# EAGLE design saw-dcc6c-breakout (EAGLE 5.11)
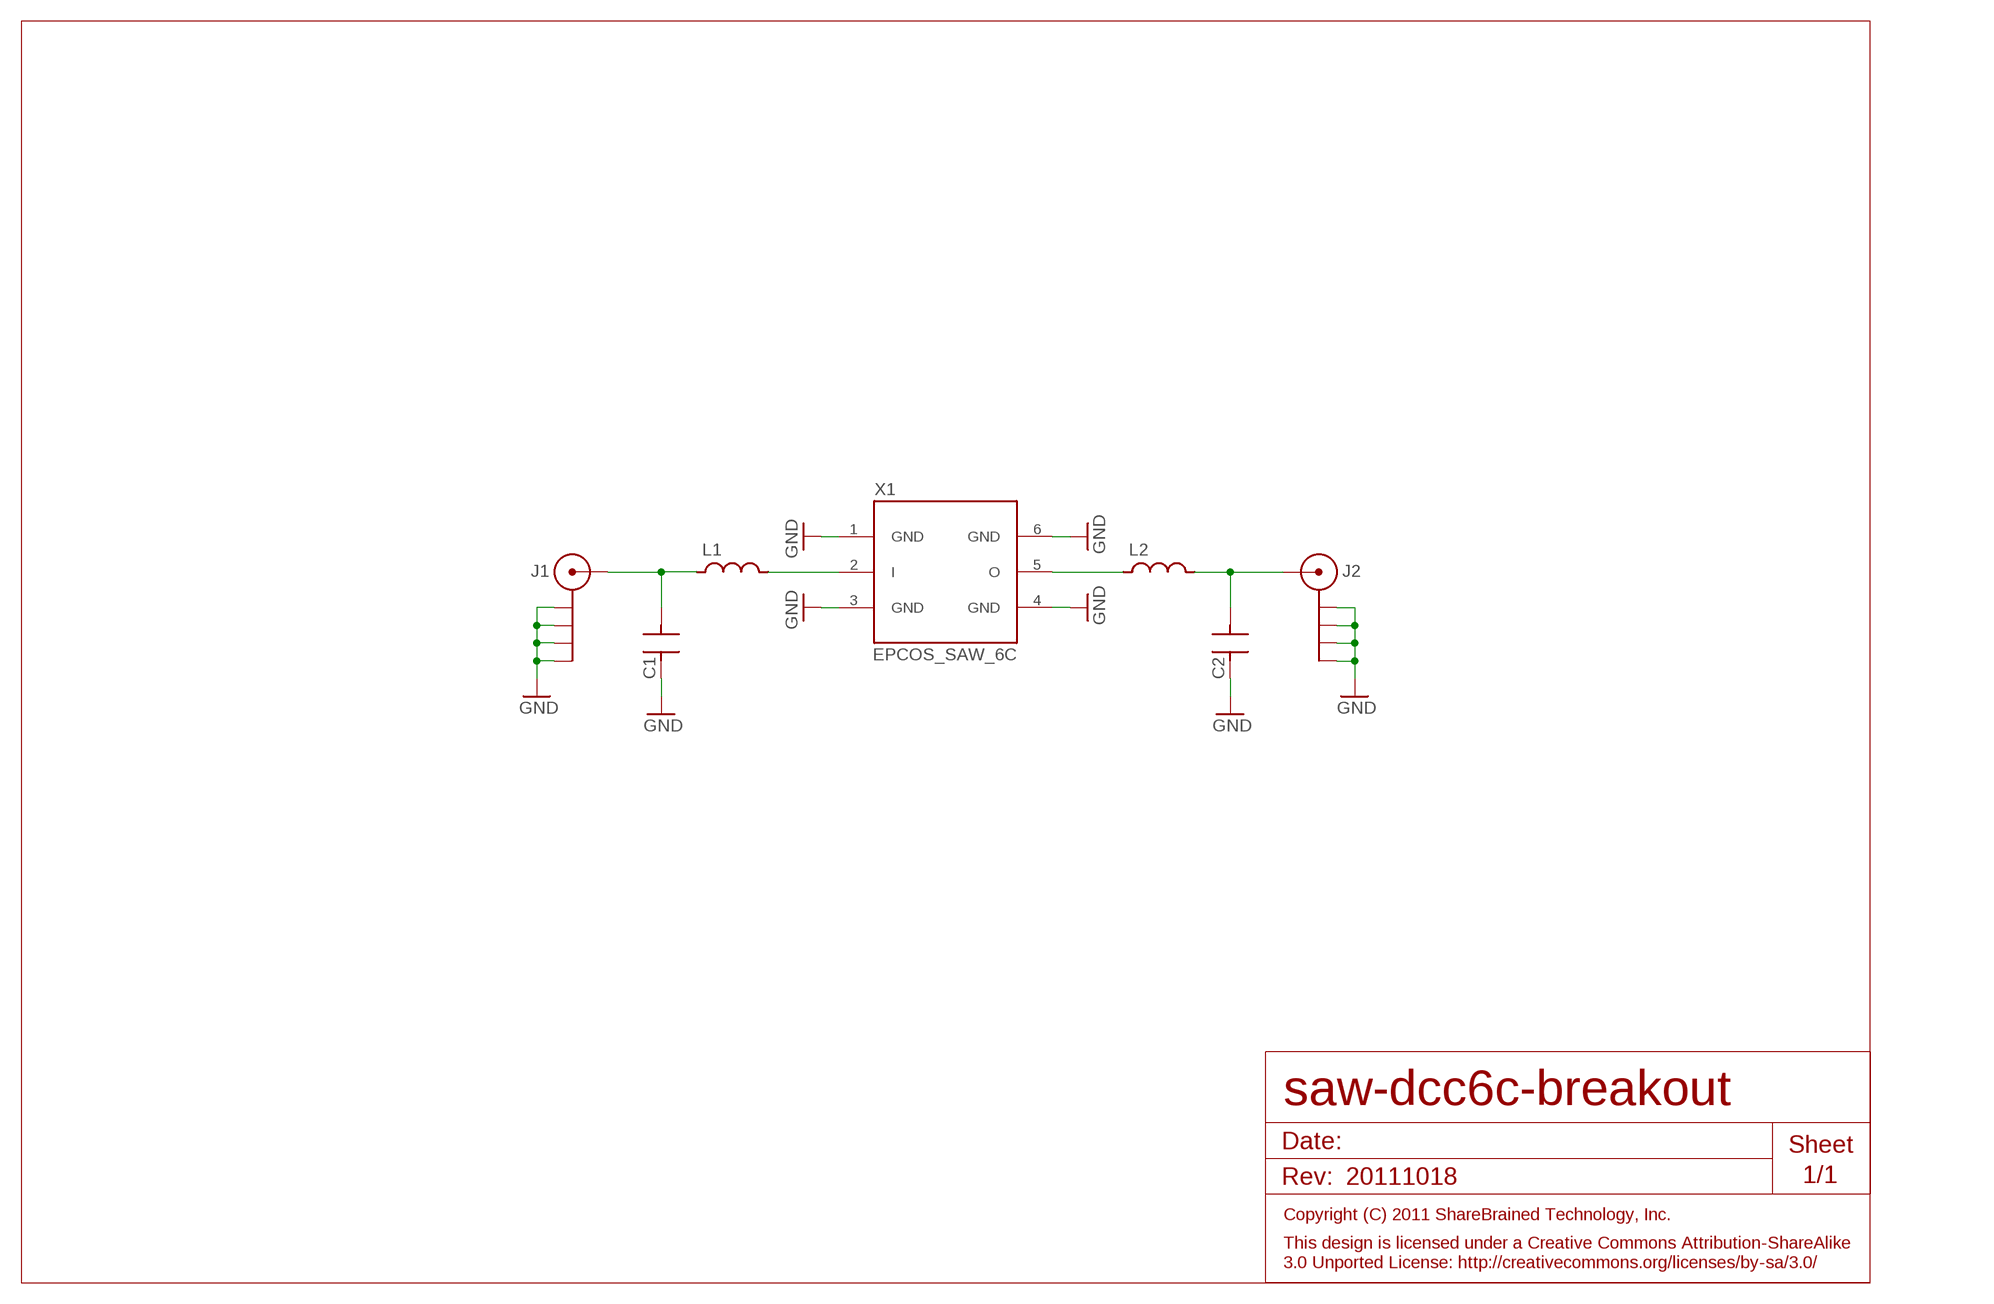
[diagram p0: schematic, sheet 1]

## Parts
C1  C0402_55  [CAPC1005X55N]
C2  C0402_55  [CAPC1005X55N]
J1  SMA142-0701-801  [142-0701-801]
J2  SMA142-0701-801  [142-0701-801]
L1  L0603_95  [INDC1608X95N]
L2  L0603_95  [INDC1608X95N]
X1  EPCOS_SAW_6C  [EPCOS_DCC6_X]

## Nets
GND: C1.1 C2.1 J1.RING@1(RING) J1.RING@2(RING) J1.RING@3(RING) J1.RING@4(RING) J2.RING@1(RING) J2.RING@2(RING) J2.RING@3(RING) J2.RING@4(RING) X1.1(GND) X1.3(GND) X1.4(GND) X1.6(GND)
N$1: L1.2 X1.2(I)
N$2: L2.1 X1.5(O)
N$3: C1.2 J1.TIP L1.1
N$4: C2.2 J2.TIP L2.2

## Notes on the sheet
- 20111018

## Library data of the parts
C1 C2 = capacitor:C
J1 J2 = sma:SMA
L1 L2 = inductor:L
X1 = filter:EPCOS_SAW_6C

## Board
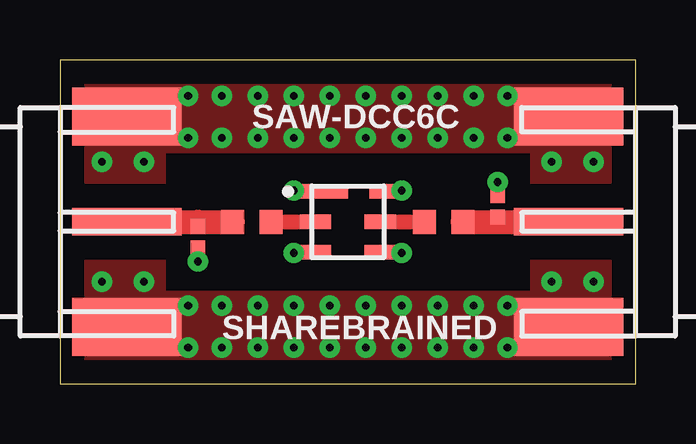
[diagram p1: board, top side]
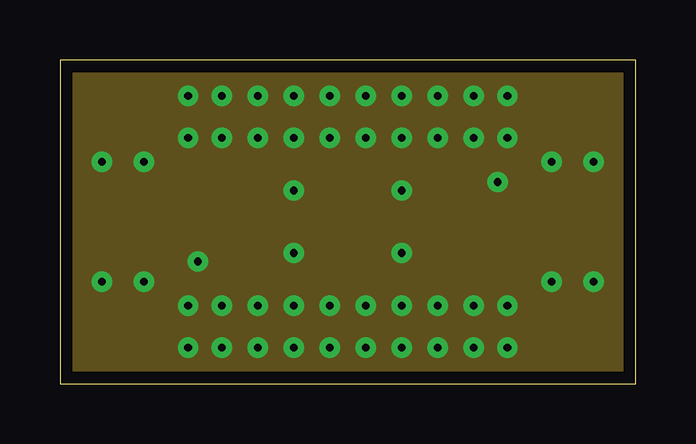
[diagram p2: board, inner layer Route2]
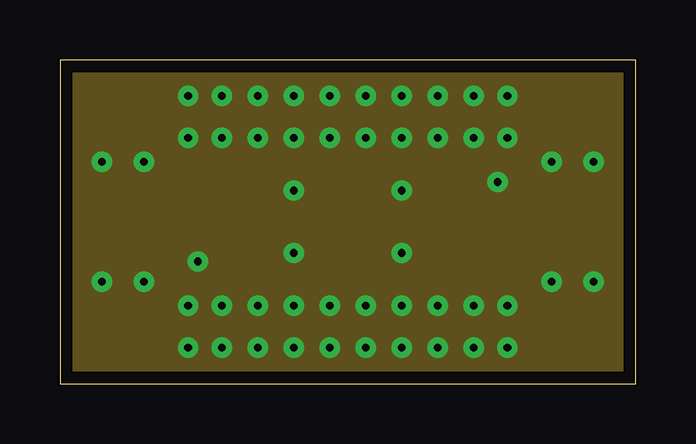
[diagram p3: board, inner layer Route15]
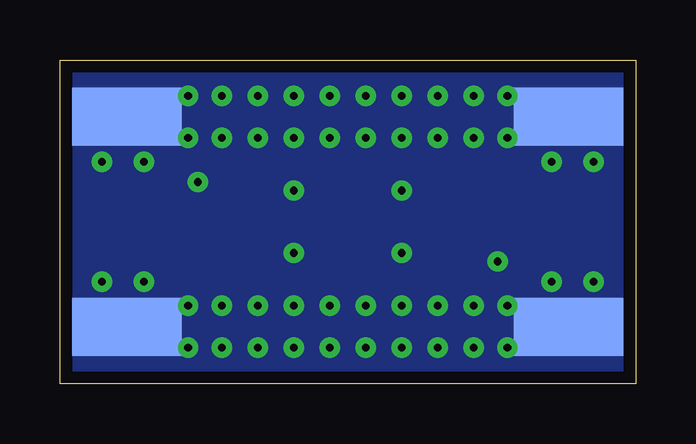
[diagram p4: board, bottom side, seen from below]

Size 24 x 13.5 mm. Coordinates in mm from the lower left corner, seen from the top.
Outline: 0,0 24,0 24,13.5 0,13.5 0,0
Copper layers (1+2*15+16): Top 0.0178mm / dielectric 0.3048mm / Route2 0.0356mm / dielectric 0.7112mm / Route15 0.0356mm / dielectric 0.3048mm / Bottom 0.0178mm
Design rules "saw-dcc6c-breakout": minimum track width 0.3mm, minimum drill 13mil, track to track 0.2mm, track to pad 0.2mm, pad to pad 0.2mm, via to via 0.2mm, smd to smd 0.2mm, copper to edge 20mil, drill to drill 16mil, minimum pad ring 10mil, minimum via ring 10mil, stop-mask expansion 3mil, vias tented up to drill 13mil, thermal gap 8mil

### Footprints (pad centres in the part's own frame; a part is rotated, then mirrored left to right if it is on the bottom)
CAPC1005X55N = smd 0.62 x 0.62: 1 -0.45,0; 2 0.45,0
142-0701-801 = smd 2.413 x 4.572: RING@1 -4.381,-2.794; RING@2 4.381,-2.794 | smd 2.413 x 4.572 bottom: RING@3 -4.381,-2.794; RING@4 4.381,-2.794 | smd 1.143 x 4.572: TIP 0,-2.794
INDC1608X95N = smd 0.95 x 1: 1 -0.8,0; 2 0.8,0
EPCOS_DCC6_X = smd 2 x 0.6: 1 -1,1.27 | smd 1.3 x 0.6: 2 -1.35,0; 3 -1.35,-1.27; 4 1.35,-1.27; 5 1.35,0 | smd 1.1 x 0.6: 6 1.45,1.27

### Placement (x,y rotation side)
C1  5.75,6.1 90 top
C2  18.25,7.4 270 top
J1  0,6.75 90 top
J2  24,6.75 270 top
L1  8,6.75 0 top
L2  16,6.75 0 top
X1  12,6.75 0 top

### Tracks (layer width: path | path; a pad name or v marks a point on that pad's centre or on a via)
GND  (via drill 0.33)
  Top 0.6: C1.1 v5.75,5.1 | C2.1 v18.25,8.4 | X1.1 9.78,8.02 v9.75,8.05 | X1.6 14.22,8.02 v14.25,8.05 | X1.3 9.78,5.48 v9.75,5.45 | X1.4 14.22,5.48 v14.25,5.45
  other vias: 5.35,10.25 1.75,9.25 8.25,10.25 9.75,10.25 11.25,10.25 18.65,10.25 6.75,10.25 5.35,12 17.25,10.25 12.75,10.25 22.25,9.25 1.75,4.25 22.25,4.25 15.75,3.25 14.25,3.25 18.65,3.25 12.75,3.25 5.35,1.5 6.75,3.25 8.25,3.25 9.75,3.25 17.25,3.25 14.25,10.25 15.75,10.25 5.35,3.25 11.25,3.25 6.75,12 8.25,12 9.75,12 11.25,12 12.75,12 14.25,12 15.75,12 17.25,12 18.65,12 6.75,1.5 8.25,1.5 9.75,1.5 11.25,1.5 12.75,1.5 14.25,1.5 15.75,1.5 17.25,1.5 18.65,1.5 3.5,9.25 3.5,4.25 20.5,4.25 20.5,9.25
  pour Route2 (no thermals): 0,0 0,13.5 24,13.5 24,0
  pour Route15 (no thermals): 0,0 0,13.5 24,13.5 24,0
  pour Top (isolate 1, no thermals): 0,7.5 0,13.5 24,13.5 24,7.5 19.75,7.5 19.75,9.75 4.25,9.75 4.25,7.5
  pour Top (isolate 1, no thermals): 0,0 0,6 4.25,6 4.25,3.75 19.75,3.75 19.75,6 24,6 24,0
  pour Bottom (no thermals): 0,0 0,13.5 24,13.5 24,0
N$1
  Top 0.6: L1.2 X1.2
N$2
  Top 0.6: L2.1 X1.5
N$3
  Top 0.5: 5.75,6.75 C1.2
  Top 1: J1.TIP 5.75,6.75 L1.1
N$4
  Top 0.5: 18.25,6.75 C2.2
  Top 1: L2.2 18.25,6.75 J2.TIP

### Text on the board
tPlace: SAW-DCC6C | SHAREBRAINED